# Altium schematic sheet Servo.SchDoc
size A4; SheetNumber: 10; SheetTotal: 15
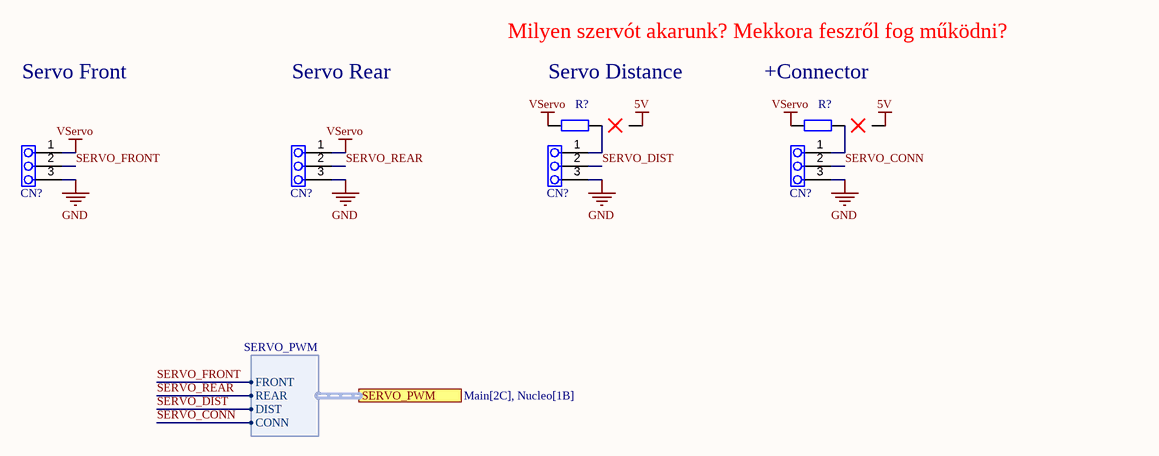
[diagram p0: Servo.SchDoc]

## Parts
(Parts that share a designator on the sheet are numbered #1, #2 ... from top to bottom, then left to right.)
CN?#1  Pins 1x3  [PIN-1X3]  (value not drawn)
CN?#2  Pins 1x3  [PIN-1X3]  (value not drawn)
CN?#3  Pins 1x3  [PIN-1X3]  (value not drawn)
CN?#4  Pins 1x3  [PIN-1X3]  (value not drawn)
R?#1  *  [RES0603 _SELECTION]  (value not drawn)
R?#2  *  [RES0603 _SELECTION]  (value not drawn)

## Ports
SERVO_PWM (harness SERVO_PWM, see Main[2C], Nucleo[1B])

## Harnesses
SERVO_PWM: REAR, FRONT, DIST, CONN

## Nets
5V: R?#1.3 R?#2.3
GND: CN?#1.3 CN?#2.3 CN?#3.3 CN?#4.3
VServo: CN?#1.1 CN?#2.1 R?#1.1 R?#2.1
SERVO_CONN: CN?#4.2 ; port SERVO_PWM.CONN
SERVO_DIST: CN?#3.2 ; port SERVO_PWM.DIST
SERVO_FRONT: CN?#1.2 ; port SERVO_PWM.FRONT
SERVO_REAR: CN?#2.2 ; port SERVO_PWM.REAR
NetCN?#3_1: CN?#3.1 R?#1.2
NetCN?#4_1: CN?#4.1 R?#2.2

## Notes on the sheet
- Milyen szervót akarunk? Mekkora feszről fog működni?
- Servo Front
- Servo Rear
- (near R?#1) Servo Distance
- (near R?#2) +Connector
- Size
- Date
- A4
- Title
- Sheet number
- Author
- Revision

## Library data of the parts
CN?#1-CN?#4 = Pins 1x3: 1x3 2.54mm; Part Class: Connector; Order Code: 855-M50-3530342; CompType: M50-3530342; Distributor: Mouser; Package: SMD 1.27mm
R?#1 R?#2 = Resistor_Selection: Resistor; Value: *